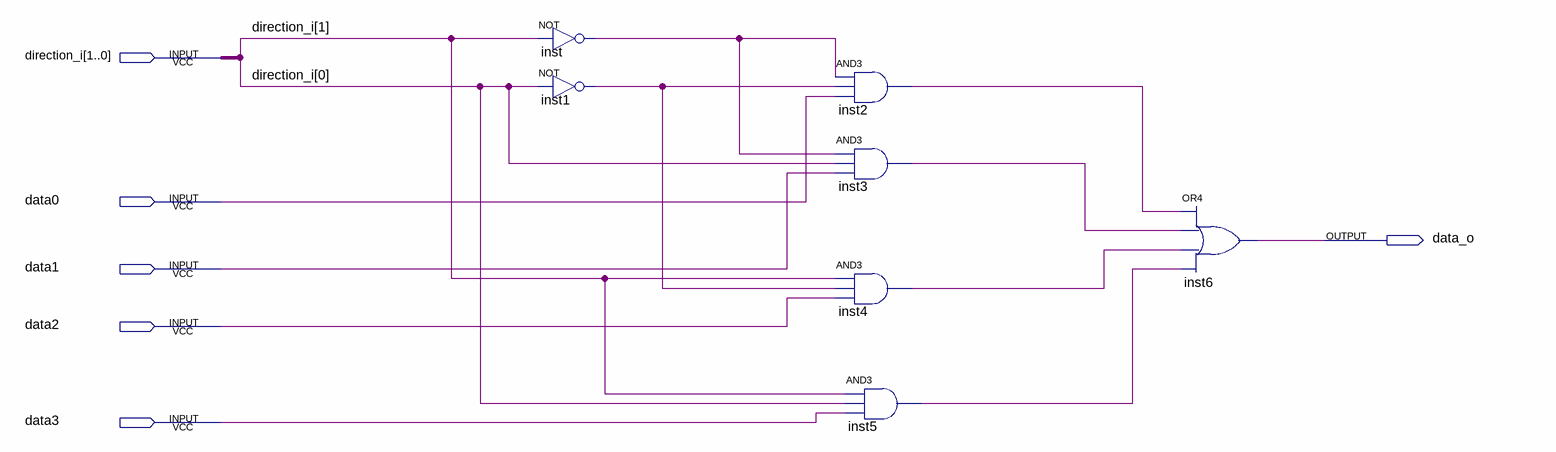
[diagram p0: schematic sheet]
// Quartus schematic mux4_1.bdf as structural Verilog: 7 symbols, 6 pins
module mux4_1 (
  input  [1:0] direction_i,
  input  data0,
  input  data1,
  input  data2,
  input  data3,
  output data_o
);

  wire inst1_out, inst2_out, inst3_out, inst4_out, inst5_out, inst_out;

  not inst (inst_out, direction_i[1]);
  not inst1 (inst1_out, direction_i[0]);
  and inst2 (inst2_out, inst_out, inst1_out, data0);
  and inst3 (inst3_out, inst_out, direction_i[0], data1);
  and inst4 (inst4_out, direction_i[1], inst1_out, data2);
  and inst5 (inst5_out, direction_i[1], direction_i[0], data3);
  or inst6 (data_o, inst2_out, inst3_out, inst4_out, inst5_out);
endmodule
